# EAGLE design upperArm_preAR (EAGLE 9.6.2)
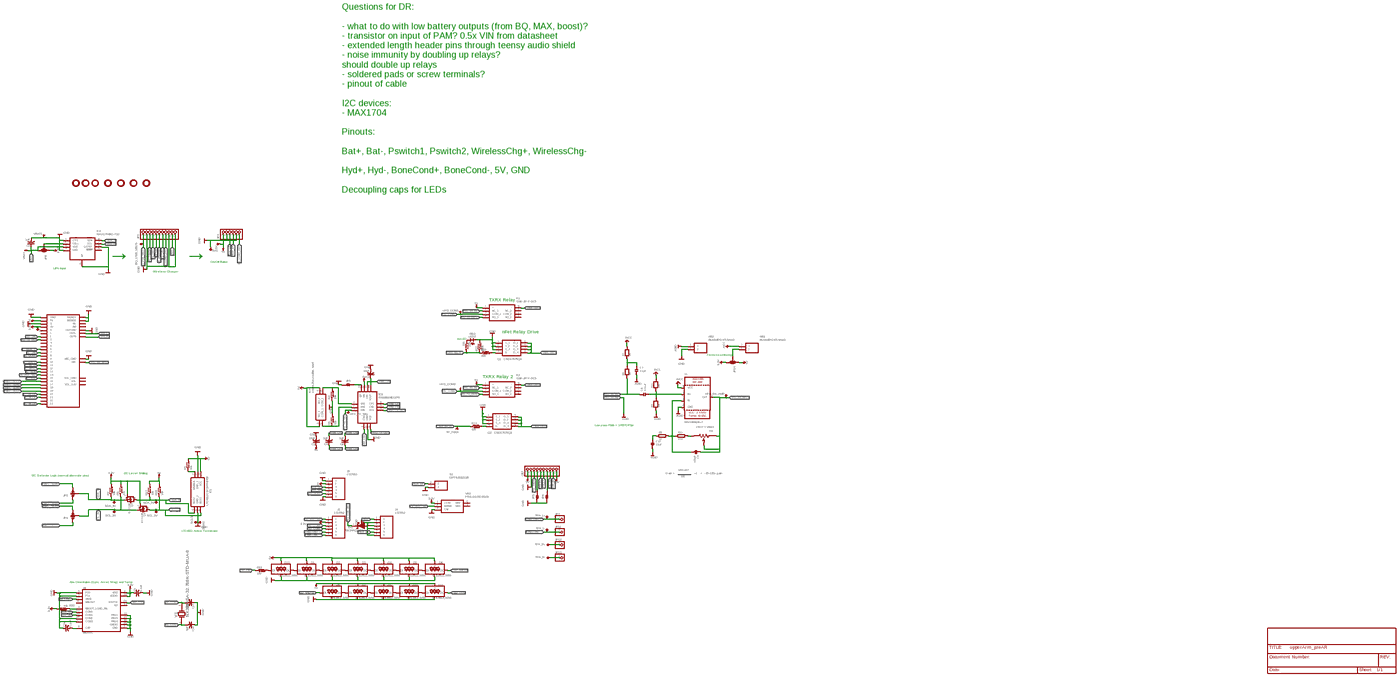
[diagram p0: schematic, sheet 1, overview]
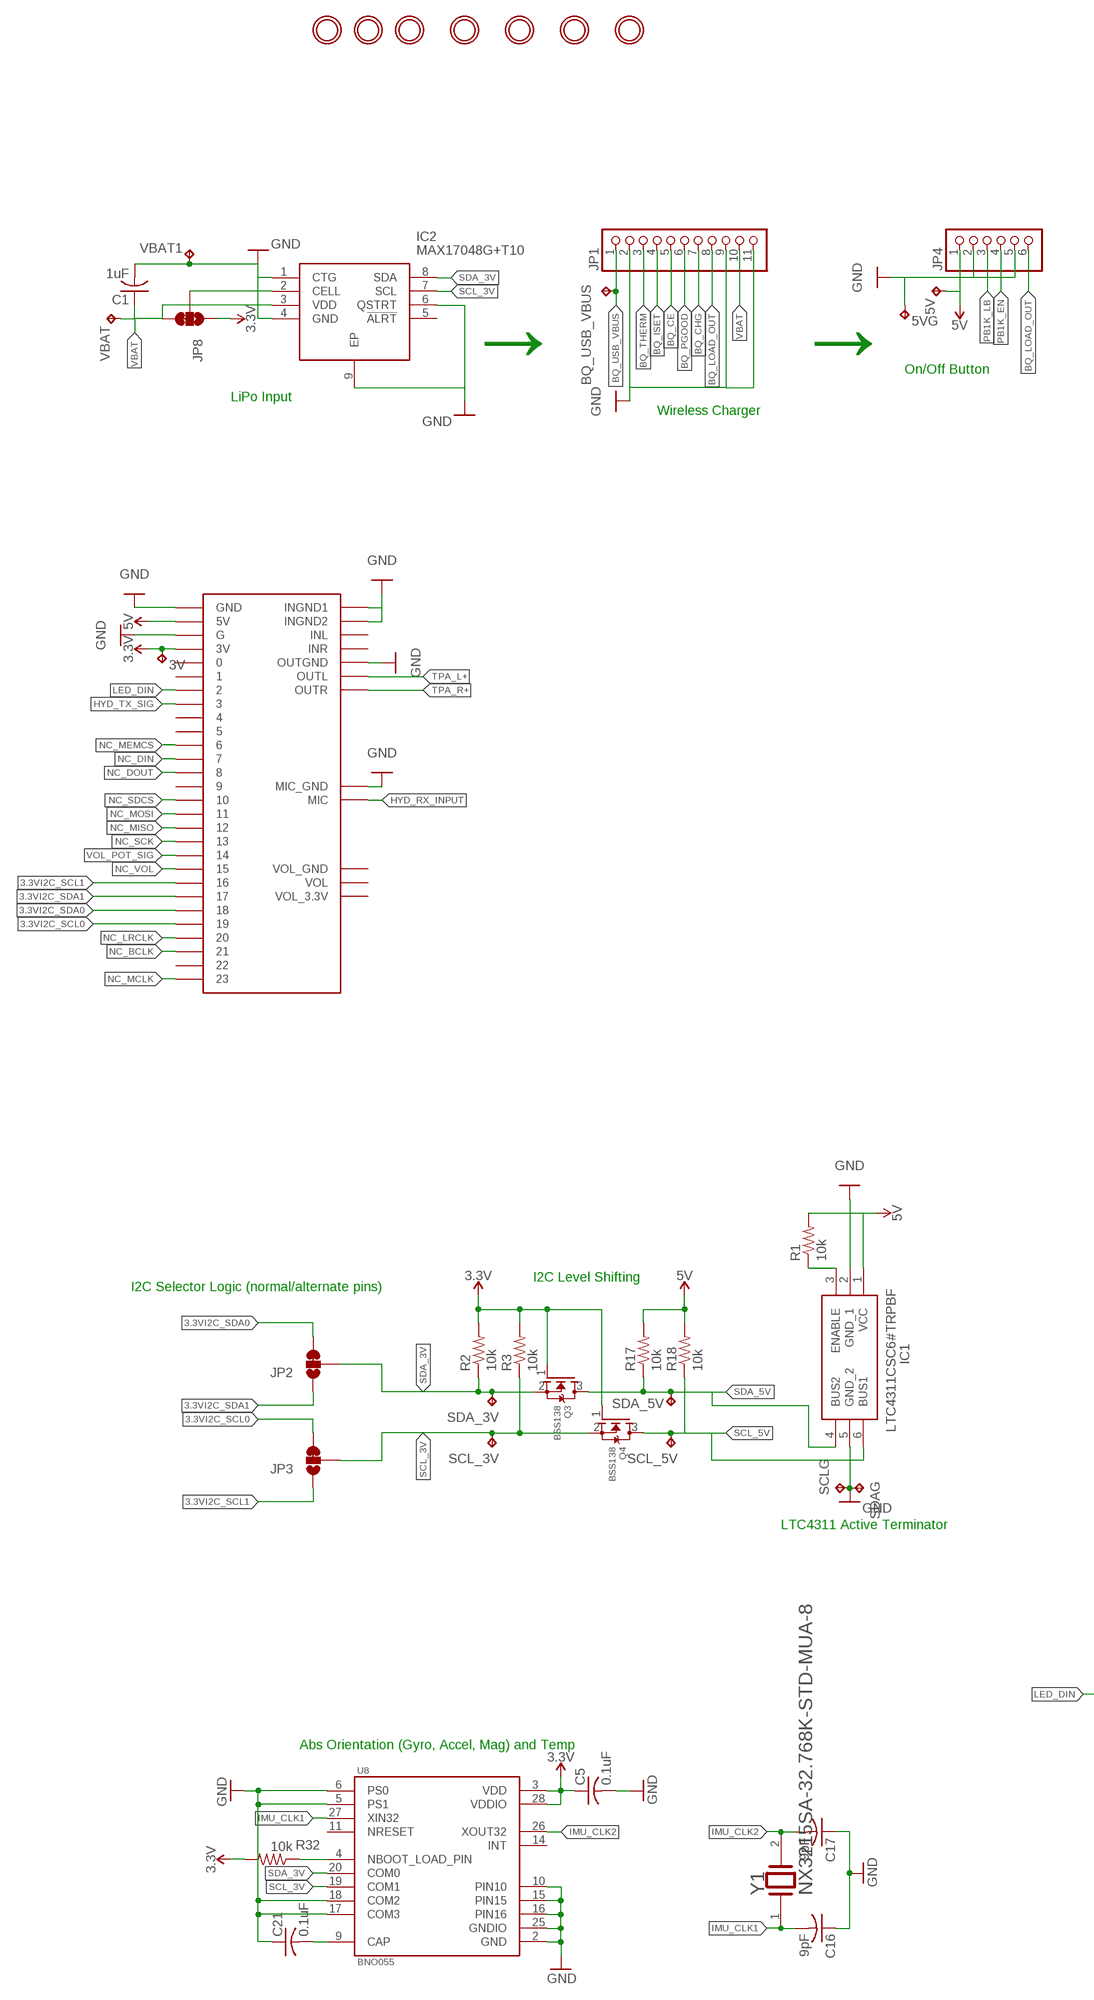
[diagram p1: schematic, sheet 1, part 1 of 4]
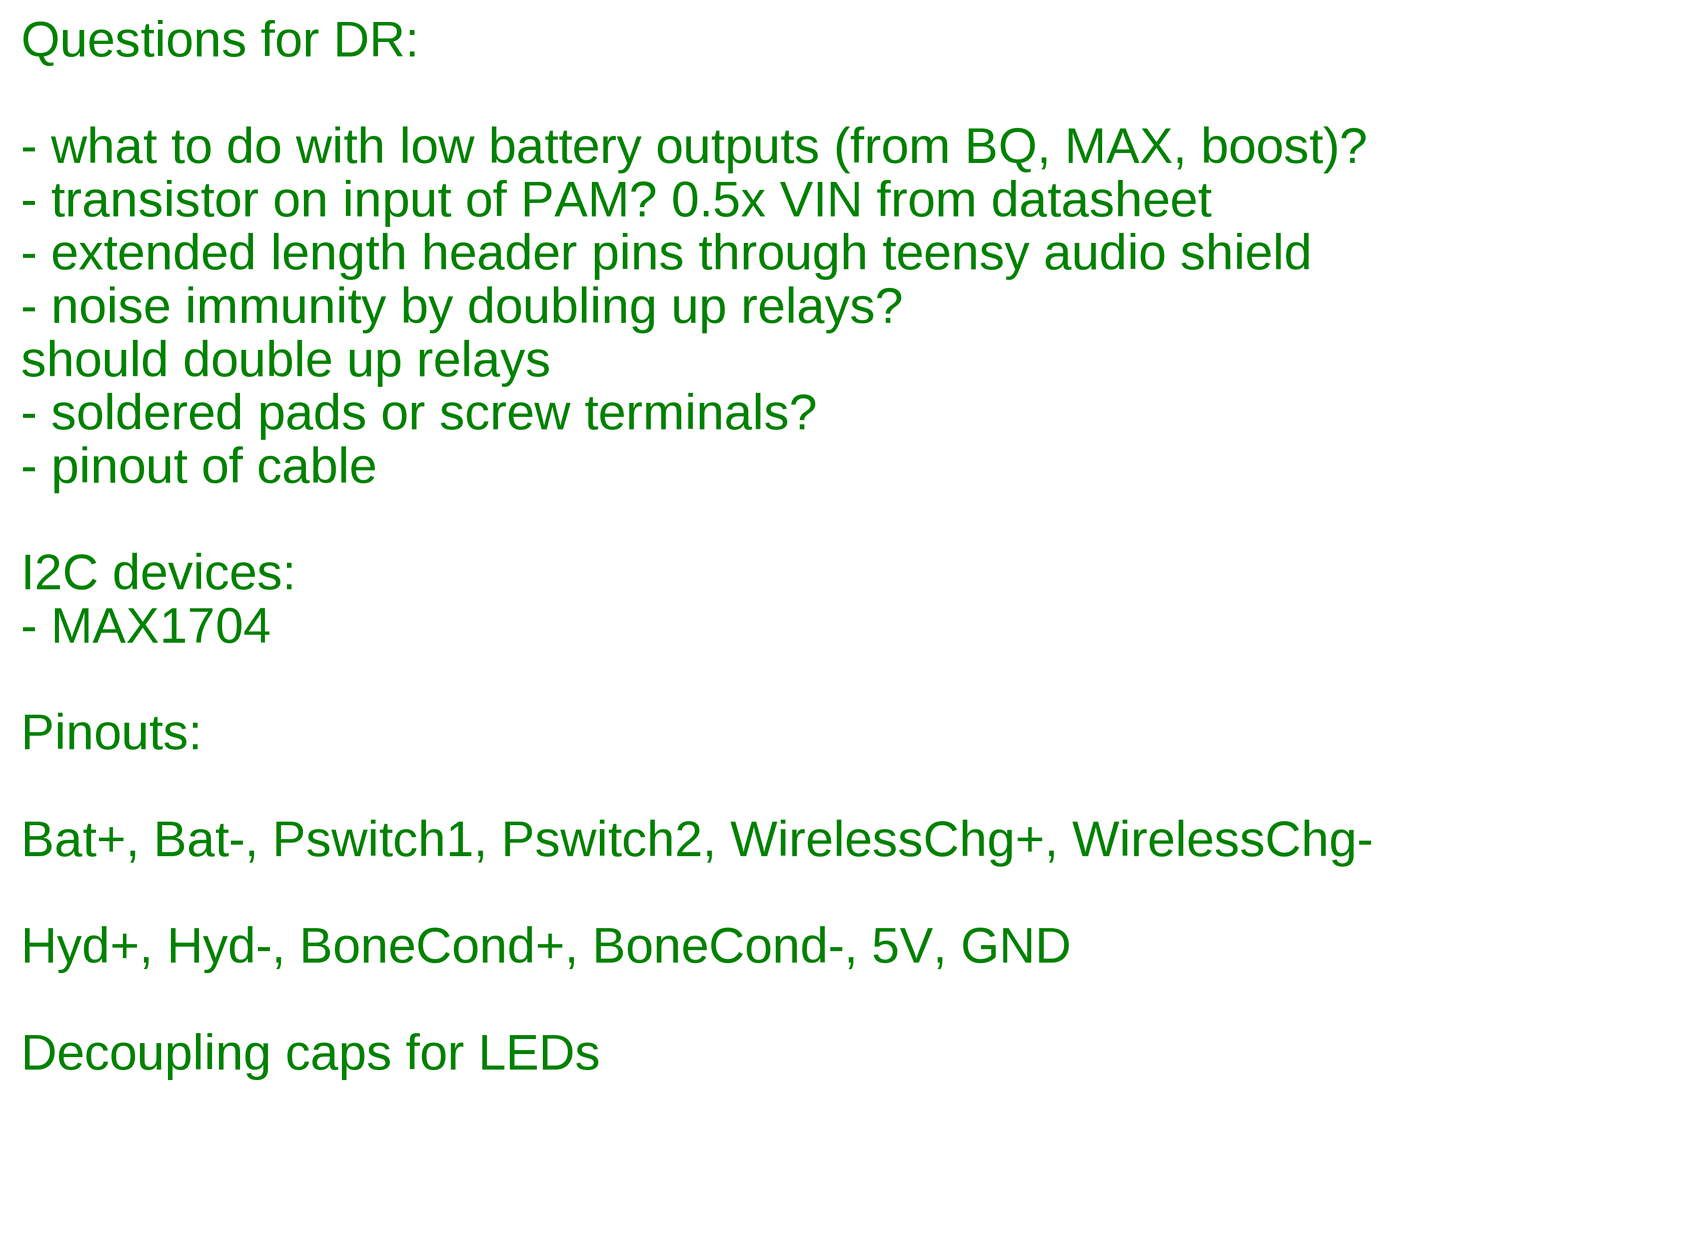
[diagram p2: schematic, sheet 1, part 2 of 4]
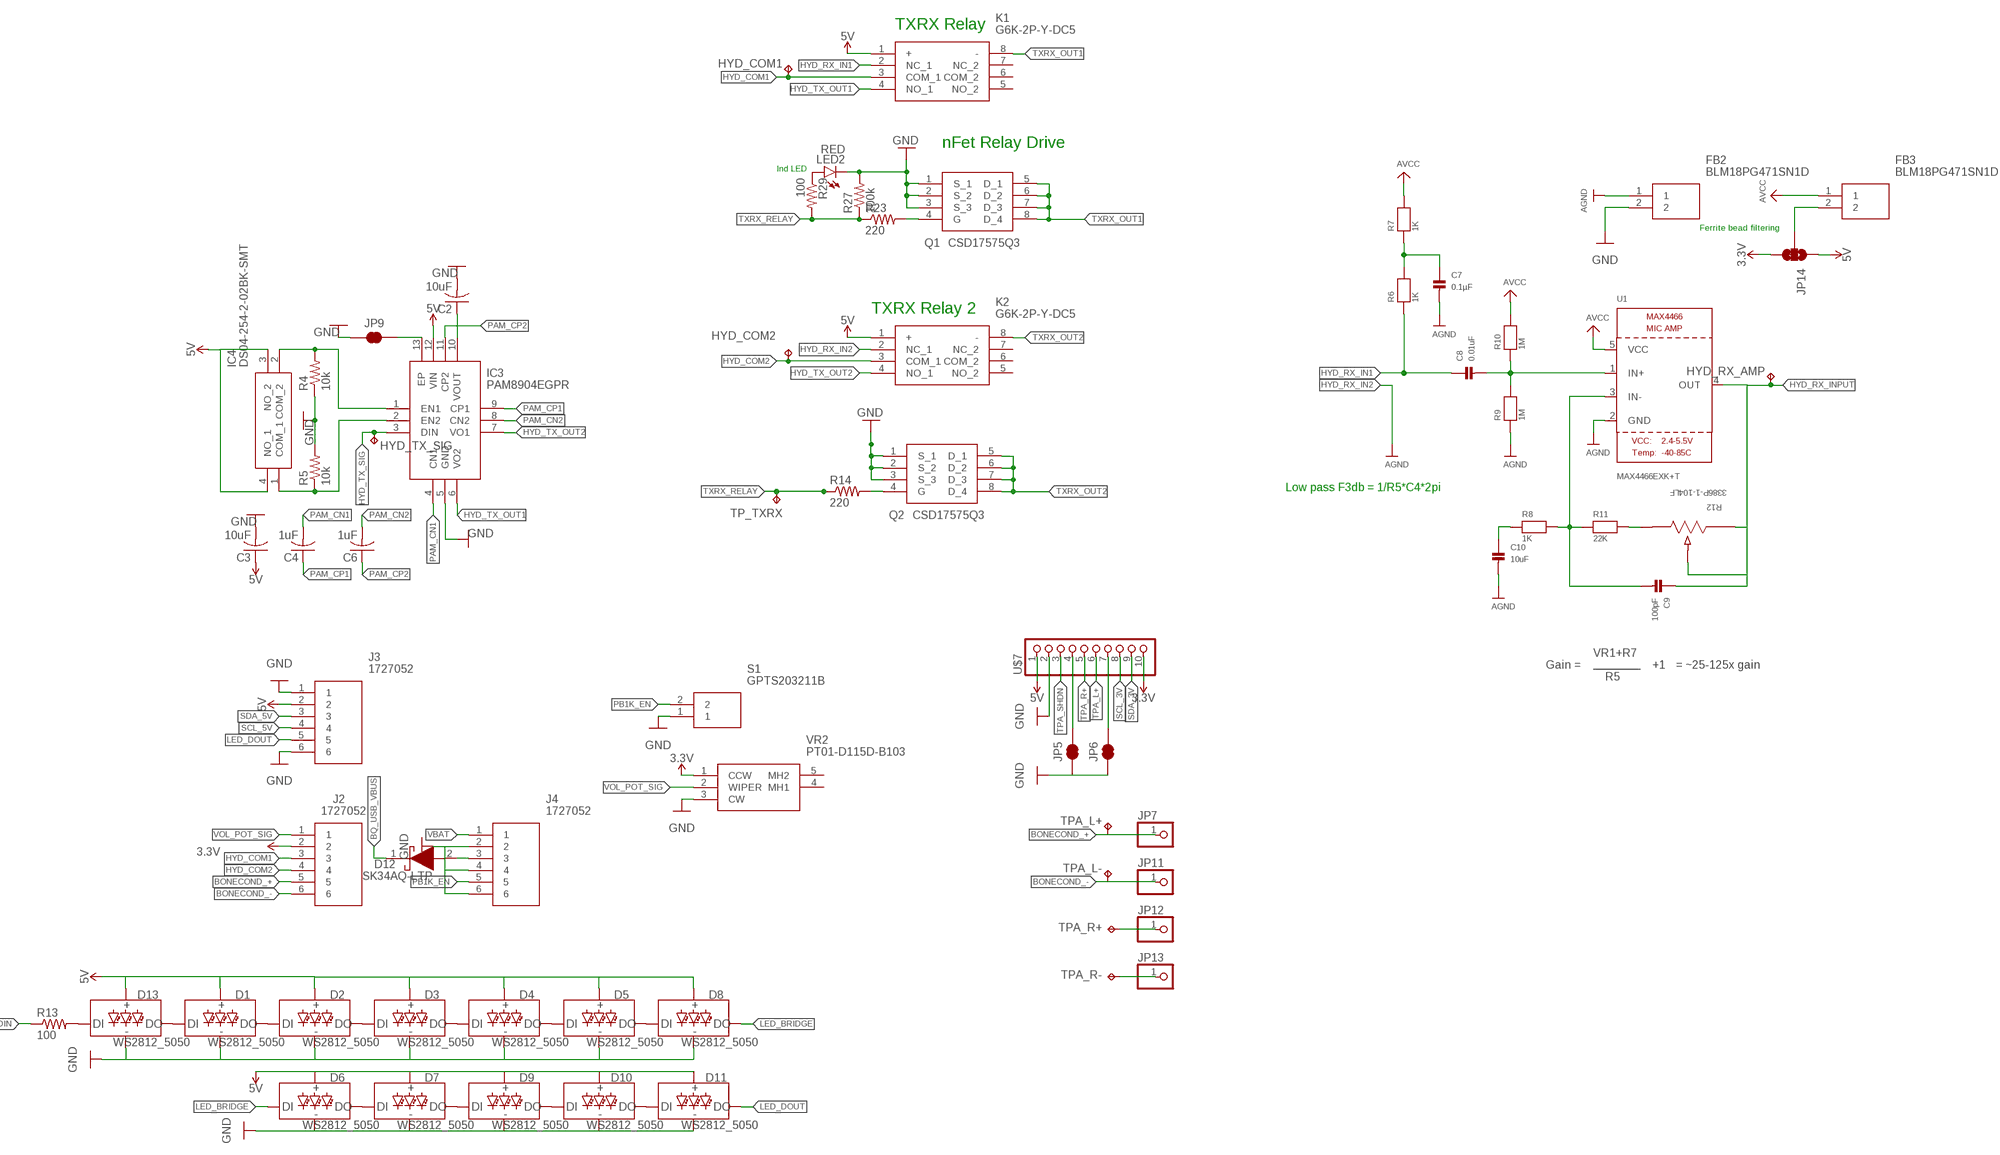
[diagram p3: schematic, sheet 1, part 3 of 4]
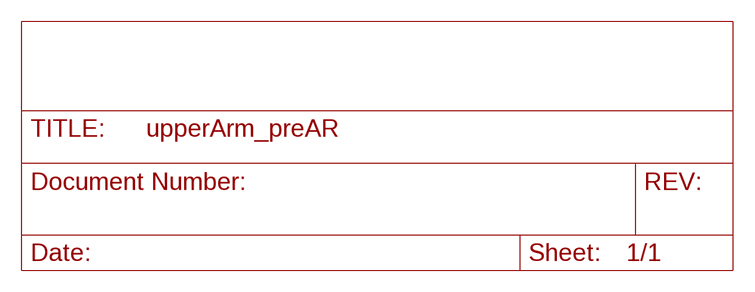
[diagram p4: schematic, sheet 1, part 4 of 4]

## Parts
3V  TPB1,27  [B1,27]
5V  TPB1,27  [B1,27]
5VG  TPB1,27  [B1,27]
BQ_USB_VBUS  TPB1,27  [B1,27]
C1  1uF  C-USC0805  [C0805]
C2  10uF  C-USC0805  [C0805]
C3  10uF  C-USC0805  [C0805]
C4  1uF  C-USC0805  [C0805]
C5  0.1uF  C-USC0805  [C0805]
C6  1uF  C-USC0805  [C0805]
C7  0.1µF  CAP_CERAMIC0805  [0805]
C8  0.01uF  CAP_CERAMIC0805  [0805]
C9  100pF  CAP_CERAMIC0805  [0805]
C10  10uF  CAP_CERAMIC0805  [0805]
C16  9pF  C-USC0805  [C0805]
C17  9pF  C-USC0805  [C0805]
C21  0.1uF  C-USC0805  [C0805]
D1  WS2812_5050  [WS2812-5X5-4PIN]
D2  WS2812_5050  [WS2812-5X5-4PIN]
D3  WS2812_5050  [WS2812-5X5-4PIN]
D4  WS2812_5050  [WS2812-5X5-4PIN]
D5  WS2812_5050  [WS2812-5X5-4PIN]
D6  WS2812_5050  [WS2812-5X5-4PIN]
D7  WS2812_5050  [WS2812-5X5-4PIN]
D8  WS2812_5050  [WS2812-5X5-4PIN]
D9  WS2812_5050  [WS2812-5X5-4PIN]
D10  WS2812_5050  [WS2812-5X5-4PIN]
D11  WS2812_5050  [WS2812-5X5-4PIN]
D12  SK34AQ-LTP  [DIOM5226X244N]
D13  WS2812_5050  [WS2812-5X5-4PIN]
FB2  BLM18PG471SN1D  [BLM18SP221SN1B]
FB3  BLM18PG471SN1D  [BLM18SP221SN1B]
HYD_COM1  TPB1,27  [B1,27]
HYD_COM2  TPB1,27  [B1,27]
HYD_RX_AMP  TPB1,27  [B1,27]
HYD_TX_SIG  TPB1,27  [B1,27]
IC1  LTC4311CSC6#TRPBF  [SOT65P210X100-6N]
IC2  MAX17048G+T10  [SON50P200X200X80-9N]
IC3  PAM8904EGPR  [QFN40P200X200X80-13N]
IC4  DS04-254-2-02BK-SMT  [DS04254202BKSMT]
J2  1727052  [1727052]
J3  1727052  [1727052]
J4  1727052  [1727052]
JP1  PINHD-1X11  [1X11]
JP2  JUMPER-SMT_3_1-NC_TRACE_NO-SILK  [SMT-JUMPER_3_1-NC_TRACE_NO-SILK]
JP3  JUMPER-SMT_3_1-NC_TRACE_NO-SILK  [SMT-JUMPER_3_1-NC_TRACE_NO-SILK]
JP4  PINHD-1X6  [1X06]
JP5  JUMPER-SMT_2_NC_TRACE_NO-SILK  [SMT-JUMPER_2_NC_TRACE_NO-SILK]
JP6  JUMPER-SMT_2_NC_TRACE_NO-SILK  [SMT-JUMPER_2_NC_TRACE_NO-SILK]
JP7  PINHD-1X1  [1X01]
JP8  JUMPER-SMT_3_1-NC_TRACE_NO-SILK  [SMT-JUMPER_3_1-NC_TRACE_NO-SILK]
JP9  JUMPER-SMT_2_NC_TRACE_NO-SILK  [SMT-JUMPER_2_NC_TRACE_NO-SILK]
JP11  PINHD-1X1  [1X01]
JP12  PINHD-1X1  [1X01]
JP13  PINHD-1X1  [1X01]
JP14  JUMPER-SMT_3_1-NC_TRACE_NO-SILK  [SMT-JUMPER_3_1-NC_TRACE_NO-SILK]
K1  G6K-2P-Y-DC5  [G6K2PYDC12]
K2  G6K-2P-Y-DC5  [G6K2PYDC12]
LED2  RED  LEDCHIP-LED0805  [CHIP-LED0805]
Q1  CSD17575Q3  [CSD16327]
Q2  CSD17575Q3  [CSD16327]
Q3  BSS138  MOSFET-NWIDE  [SOT23-WIDE]
Q4  BSS138  MOSFET-NWIDE  [SOT23-WIDE]
R1  10k  R-US_R0805  [R0805]
R2  10k  R-US_R0805  [R0805]
R3  10k  R-US_R0805  [R0805]
R4  10k  R-US_R0805  [R0805]
R5  10k  R-US_R0805  [R0805]
R6  1K  RESISTOR0805  [0805]
R7  1K  RESISTOR0805  [0805]
R8  1K  RESISTOR0805  [0805]
R9  1M  RESISTOR0805  [0805]
R10  1M  RESISTOR0805  [0805]
R11  22K  RESISTOR0805  [0805]
R12  3386P-1-104LF  [POT_3386P]
R13  100  R-US_R0603  [R0603]
R14  220  R-US_R0805  [R0805]
R17  10k  R-US_R0805  [R0805]
R18  10k  R-US_R0805  [R0805]
R23  220  R-US_R0805  [R0805]
R27  100k  R-US_R0805  [R0805]
R29  100  R-US_R0805  [R0805]
R32  10k  R-US_R0805  [R0805]
S1  GPTS203211B  [GPTS203211B]
SCL_3V  TPB1,27  [B1,27]
SCL_5V  TPB1,27  [B1,27]
SCLG  TPB1,27  [B1,27]
SDA_3V  TPB1,27  [B1,27]
SDA_5V  TPB1,27  [B1,27]
SDAG  TPB1,27  [B1,27]
TP_TXRX  TPB1,27  [B1,27]
TPA_L+  TPB1,27  [B1,27]
TPA_L-  TPB1,27  [B1,27]
TPA_R+  TPB1,27  [B1,27]
TPA_R-  TPB1,27  [B1,27]
U1  MAX4466EXK+T  MAX4466""  [SC70-5]
U8  BNO055  [LGA28R50P4X10_380X520X100]
U$1  AUDIOSHIELD  [AUDIOSHIELD]
U$7  PINHD-1X10  [1X10]
U$11  MOUNTINGHOLE2.5  [MOUNTINGHOLE_2.5_PLATED]
U$14  MOUNTINGHOLE2.5  [MOUNTINGHOLE_2.5_PLATED]
U$15  MOUNTINGHOLE2.5  [MOUNTINGHOLE_2.5_PLATED]
U$16  MOUNTINGHOLE2.5  [MOUNTINGHOLE_2.5_PLATED]
U$17  MOUNTINGHOLE2.5  [MOUNTINGHOLE_2.5_PLATED]
U$18  MOUNTINGHOLE2.5  [MOUNTINGHOLE_2.5_PLATED]
U$19  MOUNTINGHOLE2.5  [MOUNTINGHOLE_2.5_PLATED]
VBAT  TPB1,27  [B1,27]
VBAT1  TPB1,27  [B1,27]
VR2  PT01-D115D-B103  [PT01D115DB103]
Y1  NDK_NX3215SA-32.768K-STD-MUA-9  NDK_NX3215SA-32.768K-STD-MUA-8NDK_NX3215SA-32.768K-STD-MUA-8_0_0  [NDK_NX3215SA-32.768K-STD-MUA-8_0]

## Nets
3.3V [ICPower]: 3V.TP C5.1 J2.2 JP8.1 JP14.3 Q3.1(G) Q4.1(G) R2.2 R3.2 R32.2 U8.3(VDD) U8.28(VDDIO) U$1.3V U$7.10 VR2.1(CCW)
3.3VI2C_SCL0: JP3.3 U$1.19
3.3VI2C_SCL1: JP3.1 U$1.16
3.3VI2C_SDA0: JP2.3 U$1.18
3.3VI2C_SDA1: JP2.1 U$1.17
5V [ICPower]: 5V.TP C3.1 D1.VCC D2.VCC D3.VCC D4.VCC D5.VCC D6.VCC D7.VCC D8.VCC D9.VCC D10.VCC D11.VCC D13.VCC IC1.1(VCC) IC3.12(VIN) IC4.3(NO_2) IC4.4(NO_1) J3.2 JP4.1 JP14.1 K1.1(+) K2.1(+) R1.2 R17.2 R18.2 U$1.5V U$7.1
AGND: C7.2 C10.2 FB2.1 R9.1 U1.2(GND)
AVCC: FB3.1 R7.2 R10.2 U1.5(VCC)
BONECOND_+: J2.5 JP7.1 TPA_L+.TP
BONECOND_-: J2.6 JP11.1 TPA_L-.TP
BQ_CE: JP1.5
BQ_CHG: JP1.7
BQ_ISET: JP1.4
BQ_LOAD_OUT: JP1.8 JP4.6
BQ_PGOOD: JP1.6
BQ_THERM: JP1.3
BQ_USB_VBUS: BQ_USB_VBUS.TP D12.1(K) JP1.1
GND: 5VG.TP C1.2 C2.2 C3.2 C5.2 C16.1 C17.1 C21.1 D1.GND D2.GND D3.GND D4.GND D5.GND D6.GND D7.GND D8.GND D9.GND D10.GND D11.GND D13.GND FB2.2 IC1.2(GND_1) IC1.5(GND_2) IC2.1(CTG) IC2.4(GND) IC2.6(QSTRT) IC2.9(EP) IC3.5(GND) J3.1 J3.6 J4.2 J4.4 J4.6 JP1.2 JP1.9 JP1.11 JP4.2 JP4.5 JP5.1 JP6.1 JP9.1 LED2.C Q1.1(S_1) Q1.2(S_2) Q1.3(S_3) Q2.1(S_1) Q2.2(S_2) Q2.3(S_3) R4.1 R5.2 R27.2 S1.1 SCLG.TP SDAG.TP U8.2(GND) U8.5(PS1) U8.6(PS0) U8.10(PIN10) U8.15(PIN15) U8.16(PIN16) U8.17(COM3) U8.18(COM2) U8.25(GNDIO) U$1.G U$1.GND U$1.GND_MIC(MIC_GND) U$1.INGND1 U$1.INGND2 U$1.OUTGND U$7.2 VBAT1.TP VR2.3(CW)
HYD_COM1: HYD_COM1.TP J2.3 K1.3(COM_1)
HYD_COM2: HYD_COM2.TP J2.4 K2.3(COM_1)
HYD_RX_IN1: C8.1 K1.2(NC_1) R6.1
HYD_RX_IN2: K2.2(NC_1) ; supply symbol labelled AGND
HYD_RX_INPUT: C9.1 HYD_RX_AMP.TP R12.1 R12.2 U1.4(OUT) U$1.MIC
HYD_TX_OUT1: IC3.6(VO2) K1.4(NO_1)
HYD_TX_OUT2: IC3.7(VO1) K2.4(NO_1)
HYD_TX_SIG: HYD_TX_SIG.TP IC3.3(DIN) U$1.3
IMU_CLK1: C16.2 U8.27(XIN32) Y1.1
IMU_CLK2: C17.2 U8.26(XOUT32) Y1.2
LED_BRIDGE: D6.DI D8.DO
LED_DIN: R13.1 U$1.2
LED_DOUT: D11.DO J3.5
N$1: IC1.3(ENABLE) R1.1
N$2: JP12.1 TPA_R+.TP
N$3: JP13.1 TPA_R-.TP
N$4: D6.DO D7.DI
N$5: IC2.2(CELL) JP8.2
N$6: Q2.4(G) R14.2
N$7: C2.1 IC3.10(VOUT)
N$8: D13.DI R13.2
N$9: JP5.2 U$7.4
N$10: D1.DO D2.DI
N$11: IC3.13(EP) JP9.2
N$12: IC3.1(EN1) IC4.2(COM_2) R4.2
N$13: IC3.2(EN2) IC4.1(COM_1) R5.1
N$15: FB3.2 JP14.2
N$16: C7.1 R6.2 R7.1
N$17: C8.2 R9.2 R10.1 U1.1(IN+)
N$18: D1.DI D13.DO
N$19: C9.2 R8.2 R11.1 U1.3(IN-)
N$20: C10.1 R8.1
N$21: R11.2 R12.3
N$24: D12.2(A) J4.3
N$25: D2.DO D3.DI
N$26: D3.DO D4.DI
N$27: D4.DO D5.DI
N$28: D5.DO D8.DI
N$29: D7.DO D9.DI
N$30: D9.DO D10.DI
N$31: D10.DO D11.DI
N$32: JP6.2 U$7.7
N$37: C21.2 U8.9(CAP)
N$40: R32.1 U8.4(NBOOT_LOAD_PIN)
N$81: Q1.4(G) R23.2
N$82: LED2.A R29.1
NC_BCLK: U$1.21
NC_DIN: U$1.7
NC_DOUT: U$1.8
NC_LRCLK: U$1.20
NC_MCLK: U$1.23
NC_MEMCS: U$1.6
NC_MISO: U$1.12
NC_MOSI: U$1.11
NC_SCK: U$1.13
NC_SDCS: U$1.10
NC_VOL: U$1.15
PAM_CN1: C4.2 IC3.4(CN1)
PAM_CN2: C6.2 IC3.8(CN2)
PAM_CP1: C4.1 IC3.9(CP1)
PAM_CP2: C6.1 IC3.11(CP2)
PB1K_EN: J4.5 JP4.4 S1.2
PB1K_LB: JP4.3
SCL_3V: IC2.7(SCL) JP3.2 Q4.2(S) R3.1 SCL_3V.TP U8.19(COM1) U$7.8
SCL_5V: IC1.6(BUS1) J3.4 Q4.3(D) R18.1 SCL_5V.TP
SDA_3V: IC2.8(SDA) JP2.2 Q3.2(S) R2.1 SDA_3V.TP U8.20(COM0) U$7.9
SDA_5V: IC1.4(BUS2) J3.3 Q3.3(D) R17.1 SDA_5V.TP
TPA_L+: U$1.OUTL U$7.6
TPA_R+: U$1.OUTR U$7.5
TPA_SHDN: U$7.3
TXRX_OUT1 [Pyro]: K1.8(-) Q1.5(D_1) Q1.6(D_2) Q1.7(D_3) Q1.8(D_4)
TXRX_OUT2 [Pyro]: K2.8(-) Q2.5(D_1) Q2.6(D_2) Q2.7(D_3) Q2.8(D_4)
TXRX_RELAY: R14.1 R23.1 R27.1 R29.2 TP_TXRX.TP
VBAT: C1.1 IC2.3(VDD) J4.1 JP1.10 JP8.3 VBAT.TP
VOL_POT_SIG: J2.1 U$1.14 VR2.2(WIPER)
Unconnected: IC2.5(!ALRT) K1.5(NO_2) K1.6(COM_2) K1.7(NC_2) K2.5(NO_2) K2.6(COM_2) K2.7(NC_2) U8.11(NRESET) U8.14(INT) U$1.0 U$1.1 U$1.4 U$1.5 U$1.9 U$1.22 U$1.INL U$1.INR U$1.VOL U$1.VOL_3.3V U$1.VOL_GND VR2.4(MH1) VR2.5(MH2)

## Notes on the sheet
- Questions for DR:
  
  - what to do with low battery outputs (from BQ, MAX, boost)?
  - transistor on input of PAM? 0.5x VIN from datasheet 
  - extended length header pins through teensy audio shield
  - noise immunity by doubling up relays?
  should double up relays
  - soldered pads or screw terminals?
  - pinout of cable
  
  I2C devices:
  - MAX1704
  
  Pinouts:
  
  Bat+, Bat-, Pswitch1, Pswitch2, WirelessChg+, WirelessChg-
  
  Hyd+, Hyd-, BoneCond+, BoneCond-, 5V, GND
  
  Decoupling caps for LEDs
- → | →
- On/Off Button
- LiPo Input
- Wireless Charger
- TXRX Relay
- nFet Relay Drive
- Ind LED
- Ferrite bead filtering
- TXRX Relay 2
- Low pass F3db = 1/R5*C4*2pi
- VR1+R7
- I2C Selector Logic (normal/alternate pins) | I2C Level Shifting | Gain = | +1 | = ~25-125x gain
- R5
- LTC4311 Active Terminator
- Abs Orientation (Gyro, Accel, Mag) and Temp

## Library data of the parts
3V 5V 5VG BQ_USB_VBUS HYD_COM1 HYD_COM2 HYD_RX_AMP HYD_TX_SIG SCL_3V SCL_5V SCLG SDA_3V SDA_5V SDAG TP_TXRX TPA_L+ TPA_L- TPA_R+ TPA_R- VBAT VBAT1 = testpad:TP: Test pad
C1-C6 C16 C17 C21 = rcl:C-US: CAPACITOR, American symbol; SPICEPREFIX: C
C7-C10 = microbuilder:CAP_CERAMIC: Ceramic Capacitors 0402 - 0402 Surface Mount Capacitors 16pF 50V 5% [Digikey: 445-4899-2-ND] 18pF 50V 5% [Digikey: 490-1281-2-ND] 22pF 50V 5% [Digikey: 490-1283-2-ND] 68pF 50V 5% [Digikey: 490-1289-2-ND] 0.1uF 10V 10% [Digikey: 490-1318-2-ND] 1.0uF 6.3V 10% [Digikey: 490-1320-2-ND] 0603 - 0603 Surface Mount Capacitors 16 pF 50V 5% [Digikey: 445-5051-2-ND] 22 pF 50V [Digikey: PCC220ACVTR-ND] 33 pF 50V 5% [Digikey: 490-1415-1-ND] 56pF 50V 5% [Digikey: 490-1421-1-ND] 220pF 50V 5% [Digikey: 445-1285-1-ND] 680 pF 50V 2200 pF 50V 5% C0G [Digikey: 445-1297-1-ND] 5600 pF 100V 5% X7R [Digikey: 478-3711-1-ND] 0.1 µF 25V 10% [Digikey: PCC2277TR-ND] 0.22 µF 16V 10% X7R [Digikey: 445-1318-1-ND] 1.0 µF 25V 10% [Digikey: 445-5146-2-ND] 0603 - RF Specific 3pF 250V +/-0.1pF RF [Digikey: 712-1347-1-ND] 18 pF 250V 5% [Digikey: 478-3505-1-ND or 712-1322-1-ND] 56 pF 250V 5% C0G RF [Digikey: 490-4867-1-ND] 68 pF 250V RF [Digikey: 490-4868-1-ND] 0805 - 0805 Surface Mount Capacitors 220 pF 250V 2% RF Ceramic Capacitor [Digikey: 712-1398-1-ND] 1000 pF 50V 2% NP0 Ceramic Capacitor [Digikey: 478-3760-1-ND] 0.1 µF 25V 10% Ceramic Capacitor [Digikey: PCC1828TR-ND] 1.0 µF 16V 10% Ceramic Capacitor[Digikey: 490-1691-2-ND] 10.0 µF 10V 10% Ceramic Capacitor[Digikey: 709-1228-1-ND] 10.0 uF 16V 10% Ceramic Capacitor [Digikey: 478-5165-2-ND] 47 uF 6.3V 20% Ceramic Capacitor [Digikey: 587-1779-1-ND or 399-5506-1-ND] 1206 - 1206 Surface Mount Capacitors 47uF 10V 20% Ceramic Capacitor [Digikey: 490-5528-1-ND or 399-5508-1-ND or 445-6010-1-ND] 100uF 6.3V -20%, +80% Y5V Ceramic Capacitor (Digikey: 490-4512-1-ND, Mouser: 81-GRM31CF50J107ZE1L)
D1-D11 D13 = SparkFun-LED:WS2812: Addressable RGB LED - 1 Wire Common names: WS2812, SK6812, Neopixel, APA-106, etc. SMD LED with built-in controller IC. Color: Red/Green/Blue SparkFun Products: LED-SMD RGB (WS2812) <https://www.sparkfun.com/products/11821> LED - RGB Addressable, PTH, 5mm Diffused (5 Pack) <https://www.sparkfun.com/products/12986> LED - RGB Addressable, PTH, 5mm Clear (5 Pack) <https://www.sparkfun.com/products/12999> Blynk Board - ESP8266 <https://www.sparkfun.com/products/13794> Datasheet referenced for footprint: WS2812B-PTH <https://cdn.sparkfun.com/datasheets/Components/LED/COM-12877.pdf>; PROD_ID: DIO-12503
D12 = SamacSys_Parts:SK34AQ-LTP: SCHOTTKY BARRIER RECTIFIERS 40V 3A,SMA Source: Datasheet <https://mccsemi.com/pdf/Products/SK34AQ-L_SK36AQ-L(SMA).pdf>; ARROW_PART_NUMBER: SK34AQ-LTP; ARROW_PRICE-STOCK: https://www.arrow.com/en/products/sk34aq-ltp/micro-commercial-components?region=nac; DESCRIPTION: SCHOTTKY BARRIER RECTIFIERS 40V 3A,SMA; HEIGHT: 2.44mm; MANUFACTURER_NAME: MCC; MANUFACTURER_PART_NUMBER: SK34AQ-LTP; MOUSER_PART_NUMBER: 833-SK34AQ-LTP; MOUSER_PRICE-STOCK: https://www.mouser.co.uk/ProductDetail/Micro-Commercial-Components-MCC/SK34AQ-LTP?qs=ulEaXIWI0c8bpRN15seU2Q%3D%3D
FB2 FB3 = SamacSys_Parts:BLM18PG471SN1D: 0603 Ferrite Bead,470R,25%,1A,R2 Source: Datasheet <http://www.murata.com/~/media/webrenewal/support/library/catalog/products/emc/emifil/c31e.ashx?la=en-gb>; ARROW_PART_NUMBER: BLM18PG471SN1D; ARROW_PRICE-STOCK: https://www.arrow.com/en/products/blm18pg471sn1d/murata-manufacturing?region=nac; DESCRIPTION: 0603 Ferrite Bead,470R,25%,1A,R2; HEIGHT: 0.95mm; MANUFACTURER_NAME: Murata Electronics; MANUFACTURER_PART_NUMBER: BLM18PG471SN1D; MOUSER_PART_NUMBER: 81-BLM18PG471SN1D; MOUSER_PRICE-STOCK: https://www.mouser.co.uk/ProductDetail/Murata-Electronics/BLM18PG471SN1D?qs=EYzdjubb4S%2FN1Ip39GrHyg%3D%3D
IC1 = SamacSys_Parts:LTC4311CSC6#TRPBF: Interface - Specialized I2C/SMBus Rise Time Accelerator Source: Datasheet <https://www.analog.com/media/en/technical-documentation/data-sheets/4311fa.pdf>; ARROW_PART_NUMBER: LTC4311CSC6#TRPBF; ARROW_PRICE-STOCK: https://www.arrow.com/en/products/ltc4311csc6trpbf/analog-devices?region=nac; DESCRIPTION: Interface - Specialized I2C/SMBus Rise Time Accelerator; HEIGHT: 1mm; MANUFACTURER_NAME: Analog Devices; MANUFACTURER_PART_NUMBER: LTC4311CSC6#TRPBF; MOUSER_PART_NUMBER: 584-LTC4311CSC6TRPBF; MOUSER_PRICE-STOCK: https://www.mouser.co.uk/ProductDetail/Analog-Devices/LTC4311CSC6TRPBF?qs=hVkxg5c3xu8dDGkXCTUXoQ%3D%3D
IC2 = SamacSys_Parts:MAX17048G+T10: 3A 1-Cell/2-Cell Fuel Gauge with ModelGauge Source: Datasheet <https://www.analog.com/MAX17048/datasheet>; ARROW_PART_NUMBER: MAX17048G+T10; ARROW_PRICE-STOCK: https://www.arrow.com/en/products/max17048gt10/analog-devices?region=nac; DESCRIPTION: 3A 1-Cell/2-Cell Fuel Gauge with ModelGauge; HEIGHT: 0.8mm; MANUFACTURER_NAME: Analog Devices; MANUFACTURER_PART_NUMBER: MAX17048G+T10; MOUSER_PART_NUMBER: 700-MAX17048G+T10; MOUSER_PRICE-STOCK: https://www.mouser.co.uk/ProductDetail/Analog-Devices-Maxim-Integrated/MAX17048G%2bT10?qs=D7PJwyCwLAoGnnn8jEPRBQ%3D%3D
IC3 = SamacSys_Parts:PAM8904EGPR: Audio Amplifiers Audio High Volt Source: Datasheet <https://www.diodes.com//assets/Datasheets/PAM8904E.pdf>; ARROW_PART_NUMBER: PAM8904EGPR; ARROW_PRICE-STOCK: https://www.arrow.com/en/products/pam8904egpr/diodes-incorporated; DESCRIPTION: Audio Amplifiers Audio High Volt; HEIGHT: 0.8mm; MANUFACTURER_NAME: Diodes Incorporated; MANUFACTURER_PART_NUMBER: PAM8904EGPR; MOUSER_PART_NUMBER: 621-PAM8904EGPR; MOUSER_PRICE-STOCK: https://www.mouser.co.uk/ProductDetail/Diodes-Incorporated/PAM8904EGPR?qs=EBDBlbfErPxEsxcCuoWH6w%3D%3D
IC4 = SamacSys_Parts:DS04-254-2-02BK-SMT: DIP Switches / SIP Switches DIP Switch, SPST, 2.54 pitch, flat actuator, SMT, 2 position, Black Source: Datasheet <https://pt.mouser.com/datasheet/2/670/ds04_254_smt-1777718.pdf>; ARROW_PART_NUMBER: DS04-254-2-02BK-SMT; ARROW_PRICE-STOCK: https://www.arrow.com/en/products/ds04-254-2-02bk-smt/cui-devices?region=nac; DESCRIPTION: DIP Switches / SIP Switches DIP Switch, SPST, 2.54 pitch, flat actuator, SMT, 2 position, Black; HEIGHT: 4.85mm; MANUFACTURER_NAME: Same Sky; MANUFACTURER_PART_NUMBER: DS04-254-2-02BK-SMT; MOUSER_PART_NUMBER: 490-DS04254202BK-SMT; MOUSER_PRICE-STOCK: https://www.mouser.co.uk/ProductDetail/Same-Sky/DS04-254-2-02BK-SMT?qs=wnTfsH77Xs4sTcTiPxa5bg%3D%3D
J2-J4 = SamacSys_Parts:1727052: PCB terminal block, nominal current: 13.5 A, rated voltage (III/2): 200 V, nominal cross section: 1.5 mm?, Number of potentials: 6, Number of rows: 1, Number of positions per row: 6, product range: MKDS 1, pitch: 3.81 mm, connection method: Screw connection with tension sleeve, mounting: Wave soldering, conductor/PCB connection direction: 0 ?, color: green, Pin layout: Linear pinning, Solder pin [P]: 3.5 mm, type of packaging: packed in cardboard Source: Datasheet <http://www.phoenixcontact.com/de/produkte/1727052/pdf>; ARROW_PART_NUMBER: 1727052; ARROW_PRICE-STOCK: https://www.arrow.com/en/products/1727052/phoenix-contact?region=nac; DESCRIPTION: PCB terminal block, nominal current: 13.5 A, rated voltage (III/2): 200 V, nominal cross section: 1.5 mm?, Number of potentials: 6, Number of rows: 1, Number of positions per row: 6, product range: MKDS 1, pitch: 3.81 mm, connection method: Screw connection with tension sleeve, mounting: Wave soldering, conductor/PCB connection direction: 0 ?, color: green, Pin layout: Linear pinning, Solder pin [P]: 3.5 mm, type of packaging: packed in cardboard; HEIGHT: 8.65mm; MANUFACTURER_NAME: Phoenix Contact; MANUFACTURER_PART_NUMBER: 1727052; MOUSER_PART_NUMBER: 651-1727052; MOUSER_PRICE-STOCK: https://www.mouser.co.uk/ProductDetail/Phoenix-Contact/1727052?qs=WWq3Ki8dym7VpMyTMk0i8A%3D%3D
JP1 = pinhead:PINHD-1X11: PIN HEADER
JP2 JP3 JP8 JP14 = SparkFun-Jumpers:JUMPER-SMT_3_1-NC_TRACE: Normally closed trace jumper (1 of 2 connections) This jumper has a trace between two pads so it's normally closed (NC). The other connection is normally open (NO). Use a razor knife to open the connection. For best results follow the IPC guidelines for cutting traces: Cutout at least 0.063 mm (0.005 in). Remove all loose material to clean up the cut area. Seal the cut with an approved epoxy. Reapply solder to reclose the connection, or to close the NO connection.
JP4 = pinhead:PINHD-1X6: PIN HEADER
JP5 JP6 JP9 = SparkFun-Jumpers:JUMPER-SMT_2_NC_TRACE: Normally closed trace jumper This jumper has a trace between two pads so it's normally closed (NC). Use a razor knife to open the connection. For best results follow the IPC guidelines for cutting traces: Cutout at least 0.063 mm (0.005 in). Remove all loose material to clean up the cut area. Seal the cut with an approved epoxy. Reapply solder to reclose the connection.
JP7 JP11-JP13 = pinhead:PINHD-1X1: PIN HEADER
K1 K2 = SamacSys_Parts:G6K-2P-Y-DC5: Low Signal Relays - PCB ThruHole NoLatch 3.2 DPDT 5VDC 100mW Source: Datasheet <https://omronfs.omron.com/en_US/ecb/products/pdf/en-g6k.pdf>; DESCRIPTION: Low Signal Relays - PCB ThruHole NoLatch 3.2 DPDT 5VDC 100mW; HEIGHT: 5.3mm; MANUFACTURER_NAME: Omron Electronics; MANUFACTURER_PART_NUMBER: G6K-2P-Y-DC5; MOUSER_PART_NUMBER: 653-G6K-2P-Y-DC5; MOUSER_PRICE-STOCK: https://www.mouser.co.uk/ProductDetail/Omron-Electronics/G6K-2P-Y-DC5?qs=HDDQUw%2F3PhrvM4dCY49XOA%3D%3D
LED2 = led:LED: LED OSRAM: - CHIPLED LG R971, LG N971, LY N971, LG Q971, LY Q971, LO R971, LY R971 LH N974, LH R974 LS Q976, LO Q976, LY Q976 LO Q996 - Hyper CHIPLED LW Q18S LB Q993, LB Q99A, LB R99A - SideLED LS A670, LO A670, LY A670, LG A670, LP A670 LB A673, LV A673, LT A673, LW A673 LH A674 LY A675 LS A676, LA A676, LO A676, LY A676, LW A676 LS A679, LY A679, LG A679 - Hyper Micro SIDELED® LS Y876, LA Y876, LO Y876, LY Y876 LT Y87S - SmartLED LW L88C, LW L88S LB L89C, LB L89S, LG L890 LS L89K, LO L89K, LY L89K LS L896, LA L896, LO L896, LY L896 - TOPLED LS T670, LO T670, LY T670, LG T670, LP T670 LSG T670, LSP T670, LSY T670, LOP T670, LYG T670 LG T671, LOG T671, LSG T671 LB T673, LV T673, LT T673, LW T673 LH T674 LS T676, LA T676, LO T676, LY T676, LB T676, LH T676, LSB T676, LW T676 LB T67C, LV T67C, LT T67C, LS T67K, LO T67K, LY T67K, LW E67C LS E67B, LA E67B, LO E67B, LY E67B, LB E67C, LV E67C, LT E67C LW T67C LS T679, LY T679, LG T679 LS T770, LO T770, LY T770, LG T770, LP T770 LB T773, LV T773, LT T773, LW T773 LH T774 LS E675, LA E675, LY E675, LS T675 LS T776, LA T776, LO T776, LY T776, LB T776 LHGB T686 LT T68C, LB T68C - Hyper Mini TOPLED® LB M676 - Mini TOPLED Santana® LG M470 LS M47K, LO M47K, LY M47K Source: http://www.osram.convergy.de LUXEON: - LUMILED® LXK2-PW12-R00, LXK2-PW12-S00, LXK2-PW14-U00, LXK2-PW14-V00 LXK2-PM12-R00, LXK2-PM12-S00, LXK2-PM14-U00 LXK2-PE12-Q00, LXK2-PE12-R00, LXK2-PE12-S00, LXK2-PE14-T00, LXK2-PE14-U00 LXK2-PB12-K00, LXK2-PB12-L00, LXK2-PB12-M00, LXK2-PB14-N00, LXK2-PB14-P00, LXK2-PB14-Q00 LXK2-PR12-L00, LXK2-PR12-M00, LXK2-PR14-Q00, LXK2-PR14-R00 LXK2-PD12-Q00, LXK2-PD12-R00, LXK2-PD12-S00 LXK2-PH12-R00, LXK2-PH12-S00 LXK2-PL12-P00, LXK2-PL12-Q00, LXK2-PL12-R00 Source: www.luxeon.com KINGBRIGHT: KA-3528ASYC Source: www.kingbright.com
Q1 Q2 = SamacSys_Parts:CSD17575Q3: 30V, N ch NexFET MOSFET, single SON3x3, 3.2mOhm Source: Datasheet <http://www.ti.com/lit/gpn/csd17575q3>; ARROW_PART_NUMBER: CSD17575Q3; ARROW_PRICE-STOCK: https://www.arrow.com/en/products/csd17575q3/texas-instruments; DESCRIPTION: 30V, N ch NexFET MOSFET, single SON3x3, 3.2mOhm; HEIGHT: mm; MANUFACTURER_NAME: Texas Instruments; MANUFACTURER_PART_NUMBER: CSD17575Q3; MOUSER_PART_NUMBER: 595-CSD17575Q3; MOUSER_PRICE-STOCK: https://www.mouser.co.uk/ProductDetail/Texas-Instruments/CSD17575Q3?qs=1MXlzafEN3%2FTIl0%2FpyGUYQ%3D%3D
Q3 Q4 = microbuilder:MOSFET-N: N-Channel Mosfet LEGEND VDS: Voltage Drain-Source ID: Drain Current RDS(ON): Drain-Source On-State Resistance VGS(TH): Gate-Source Threshold Voltage CISS: Drain-Source Input Capacitance SOT-23 Name VDS ID RDS(ON) VGS(TH) CISS Order Number 2N7002E 60V 260mA 2.5 Ohm 2.5V @ 250uA 26.7pF @ 25V 2N7002ET1GOSTR-ND BSH103 30V 850mA 400 mOhm 400mV @ 1mA 83pF @ 24V BSH103,235-ND BSS138 60V 320mA 1.6 Ohm 1.5V @ 250uA 50pF @ 10V Mouser: 771-BSS138PW115 DMN2075U-7 20V 4.2A 38 mOhm 1V @ 250 uA 594.3pF @ 10V DMN2075U-7DICT-ND * BSS138 good choice for I2C level-shifting
R1-R5 R13 R14 R17 R18 R23 R27 R29 R32 = rcl:R-US_: RESISTOR, American symbol; SPICEPREFIX: R
R6-R11 = microbuilder:RESISTOR: Resistors 0402 - 0402 Surface Mount Package 22 Ohm 1% 1/16W [Digikey: 311-22.0LRTR-ND] 33 Ohm 5% 1/16W 1.0K 5% 1/16W 1.5K 5% 1/16W 2.0K 1% 1/16W 10.0K 1% 1/16W [Digikey: 311-10.0KLRTR-ND] 10.0K 5% 1/16W [Digikey: RMCF0402JT10K0TR-ND] 12.1K 1% 1/16W [Digikey: 311-22.0LRTR-ND] 100.0K 5% 1/16W 0603 - 0603 Surface Mount Package 0 Ohm 1/10 Watt 1% Resistor 15 Ohm 1/10 Watt 1% Resistor 33 Ohm 1/10 Watt 1% Resistor 49.9 Ohm 1/10 Watt 1% Resistor 100 Ohm 1/10 Watt 1% Resistor 150 Ohm 1/10 Watt 1% Resistor 240 Ohm 1/10 Watt 1% Resistor 390 Ohm 1/10 Watt 1% Resistor 560 Ohm 1/10 Watt 1% Resistor 680 Ohm 1/10 Watt 1% Resistor 750 Ohm 1/10 Watt 1% Resistor 1.0K Ohm 1/10 Watt 1% Resistor 1.5K Ohm 1/10 Watt 1% Resistor 2.0K Ohm 1/10 Watt 1% Resistor 2.2K Ohm 1/10 Watt 1% Resistor 3.3K Ohm 1/10 Watt 1% Resistor 4.7K Ohm 1/10 Watt 1% Resistor 10.0K Ohm 1/10 Watt 1% Resistor 12.0K Ohm 1/10 Watt 1% Resistor 12.1K Ohm 1/10 Watt 1% Resistor 20.0K Ohm 1/10 Watt 1% Resistor 33.0K Ohm 1/10 Watt 1% Resistor 100.0K Ohm 1/10 Watt 1% Resistor 0805 - 0805 Surface Mount Package 0 Ohm 1/8 Watt 1% Resistor 33 Ohm 1/8 Watt 1% Resistor 100 Ohm 1/8 Watt 1% Resistor 150 Ohm 1/8 Watt 1% Resistor 200 Ohm 1/8 Watt 1% Resistor 240 Ohm 1/8 Watt 1% Resistor 330 Ohm 1/8 Watt 1% Resistor 390 Ohm 1/8 Watt 1% Resistor 470 Ohm 1/8 Watt 1% Resistor 1.0K Ohm 1/8 Watt 1% Resistor 1.5K Ohm 1/8 Watt 1% Resistor 2.0K Ohm 1/8 Watt 1% Resistor 4.7K Ohm 1/8 Watt 1% Resistor 5.1K Ohm 1/8 Watt 1% Resistor 5.6K Ohm 1/8 Watt 1% Resistor 10.0K Ohm 1/8 Watt 1% Resistor 22.0K Ohm 1/8 Watt 1% Resistor 33.0K Ohm 1/8 Watt 1% Resistor 100K Ohm 1/8 Watt 1% Resistor 1206 - 1206 Surface Mount Package 2012 - 2010 Surface Mount Package 0.11 Ohm 1/2 Watt 1% Resistor - Digikey: RHM.11UCT-ND
R12 = 3386P-1-104LF:3386P-1-104LF; COPYRIGHT: Copyright (C) 2024 Ultra Librarian. All rights reserved.; MANUFACTURER_PART_NUMBER: 3386P-1-104LF; MFR_NAME: Bourns Electronics
S1 = SamacSys_Parts:GPTS203211B: Pushbutton Switches SPST ON-OFF Source: Datasheet <http://switches-connectors-custom.cwind.com/Asset/GPTS203211BR2.pdf>; DESCRIPTION: Pushbutton Switches SPST ON-OFF; HEIGHT: mm; MANUFACTURER_NAME: CW Industries; MANUFACTURER_PART_NUMBER: GPTS203211B; MOUSER_PART_NUMBER: 629-GPTS203211B; MOUSER_PRICE-STOCK: https://www.mouser.co.uk/ProductDetail/CW-Industries/GPTS203211B?qs=sajaCoHCXPR%252BmLwibobs6Q%3D%3D
U1 = microbuilder:MAX4466: MAX4466 - Microphone Pre-Amp
U8 = BNO055:BNO055: BNO055 9-axis Absolute Orientation Sensor ( SiP ) w/Sensors and Sensor Fusion Buy Part <https://snapeda.com/parts/BNO055/Bosch/view-part/?ref=eda>; AVAILABILITY: Warning; DESCRIPTION: Accelerometer, Gyroscope, Magnetometer, 9 Axis Sensor I²C, UART Output; DIGIKEY-PURCHASE-URL: https://snapeda.com/shop?store=DigiKey&id=51961; MF: Bosch; MOUSER-PURCHASE-URL: https://snapeda.com/shop?store=Mouser&id=51961; MP: BNO055; PACKAGE: LGA-28 Bosch; PRICE: None
U$1 = Teensy_Audioshield:AUDIOSHIELD: Teensy 3 Audioshield by PJRC.COM
U$7 = pinhead:PINHD-1X10: PIN HEADER
U$11 U$14-U$19 = microbuilder:MOUNTINGHOLE: Mounting Hole For #2 screws (0.086"/2.18mm width, 0.094"/2.4mm hole) use 2.5mm; BOM: EXCLUDE
VR2 = SamacSys_Parts:PT01-D115D-B103: 10k Ohm 1 Gang Linear Through Hole Potentiometer 1.0 Turns Carbon 0.05W, 1/20W PC Pins Source: Datasheet <https://www.cuidevices.com/product/product-resources/pt01.pdf>; DESCRIPTION: 10k Ohm 1 Gang Linear Through Hole Potentiometer 1.0 Turns Carbon 0.05W, 1/20W PC Pins; HEIGHT: 15.5mm; MANUFACTURER_NAME: Same Sky; MANUFACTURER_PART_NUMBER: PT01-D115D-B103; MOUSER_PART_NUMBER: 179-PT01-D115D-B103; MOUSER_PRICE-STOCK: https://www.mouser.co.uk/ProductDetail/Same-Sky/PT01-D115D-B103?qs=Rp5uXu7WBW%252Bmp1sh9GThaA%3D%3D
Y1 = NDK - NX3215SA-32.768K-STD-MUA-8:NDK_NX3215SA-32.768K-STD-MUA-8: Crystal Unit; CENTROID_NOT_SPECIFIED: No; DATASHEET: http://www.ndk.com/images/products/catalog/c_NX3215SA-STD-MUA-14_e.pdf; DIGIKEY_DESCRIPTION: CRYSTAL 32.7680KHZ 12.5PF SMD; DIGIKEY_PART_NUMBER: 644-1156-1-ND; FREQUENCY: 32.768kHz; LEAD_FREE: yes; MF: NDK; MPN: NX3215SA-32.768K-STD-MUA-8; PACKAGE: XTAL_3MM2_1MM5; PREFIX: Y; ROHS: yes; TEMPERATURE_RANGE_HIGH: +85°C; TEMPERATURE_RANGE_LOW: -40°C

## Board
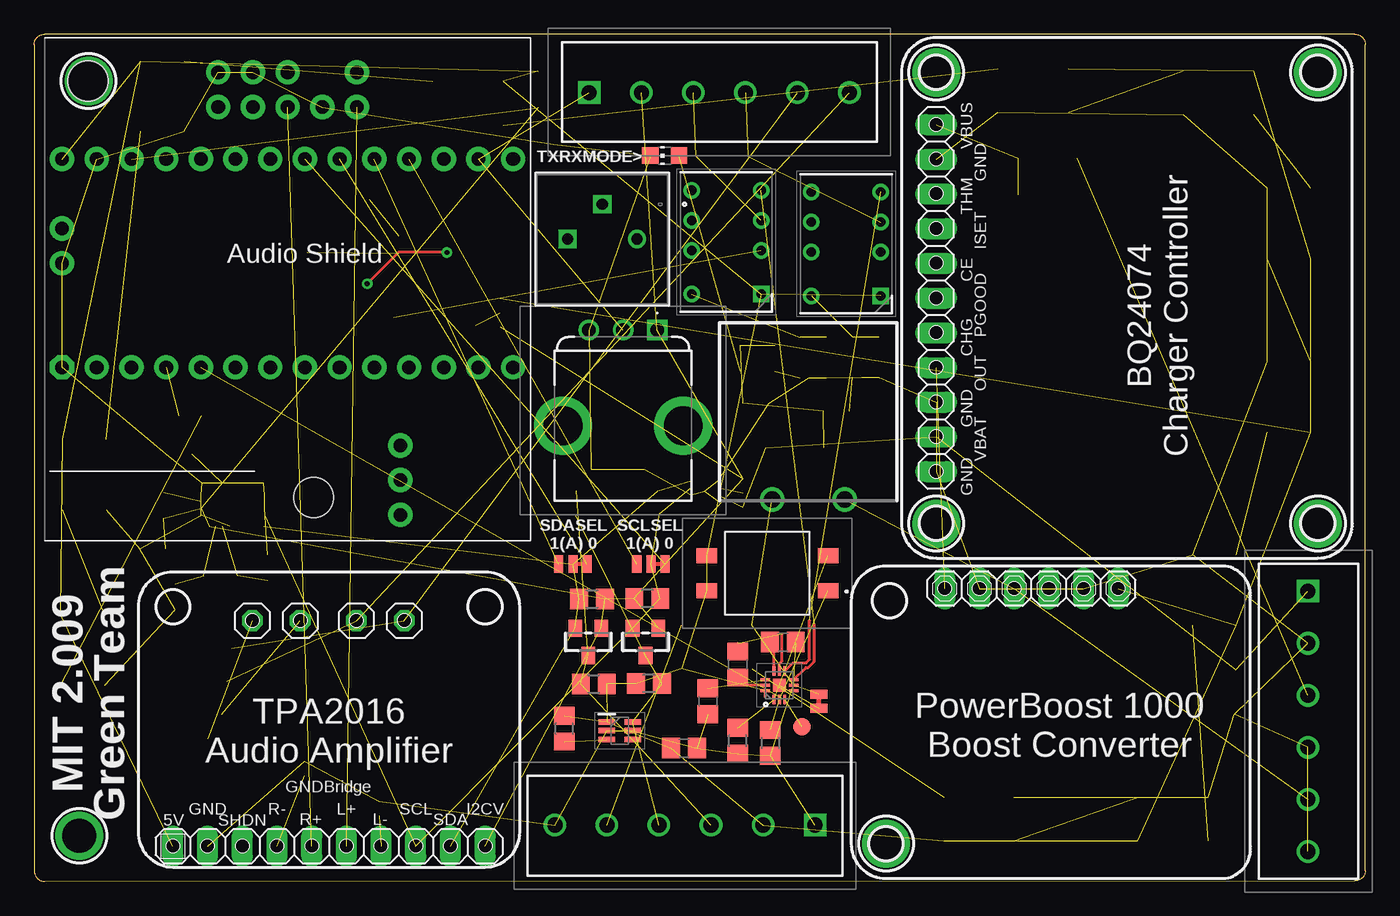
[diagram p5: board, top side]
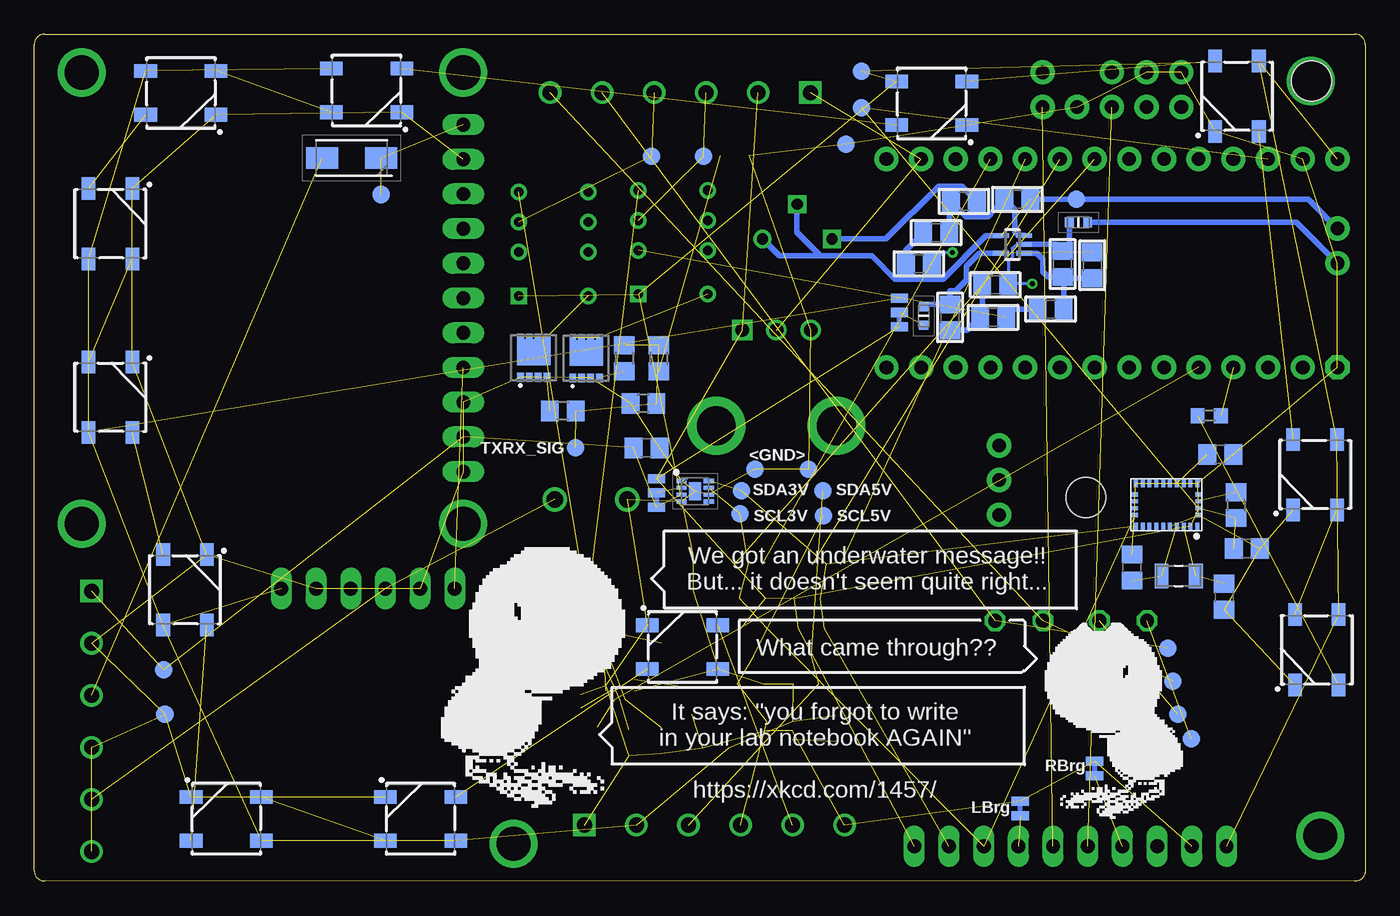
[diagram p6: board, bottom side, seen from below]

Size 97.46 x 62 mm. Coordinates in mm from the lower left corner, seen from the top.
Outline: 0.76,0 96.7,0.03 arc90 97.46,0.79 97.46,61.24 arc90 96.7,62 0.76,62 arc90 0,61.24 0,0.79 arc90 0.76,0
Copper layers (1*16): Top 0.035mm / dielectric 1.5mm / Bottom 0.035mm
Design rules "default": minimum track width 6mil, minimum drill 0.35mm, track to track 6mil, track to pad 6mil, pad to pad 6mil, via to via 6mil, smd to smd 6mil, copper to edge 40mil, drill to drill 6mil, minimum pad ring 10mil, minimum via ring 8mil, stop-mask expansion 4mil, vias tented up to drill 0mil, thermal gap 10mil

### Footprints (pad centres in the part's own frame; a part is rotated, then mirrored left to right if it is on the bottom)
B1,27 = smd 1.27 x 1.27: TP 0,0
C0805 = smd 1.3 x 1.5: 1 -0.95,0; 2 0.95,0
0805 = smd 1.3 x 1.5: 1 -0.95,0; 2 0.95,0
WS2812-5X5-4PIN = smd 1.651 x 1: DI 2.577,1.6; DO -2.577,-1.6; GND 2.577,-1.6; VCC -2.577,1.6
DIOM5226X244N = smd 2.35 x 1.55: 1 -2.15,0; 2 2.15,0
BLM18SP221SN1B = smd 0.65 x 0.7: 1 -0.675,0; 2 0.675,0
SOT65P210X100-6N = smd 1.2 x 0.4: 1 -0.95,0.65; 2 -0.95,0; 3 -0.95,-0.65; 4 0.95,-0.65; 5 0.95,0; 6 0.95,0.65
SON50P200X200X80-9N = smd 0.75 x 0.3: 1 -1,0.75; 2 -1,0.25; 3 -1,-0.25; 4 -1,-0.75; 5 1,-0.75; 6 1,-0.25; 7 1,0.25; 8 1,0.75 | smd 0.9 x 1.3: 9 0,0
QFN40P200X200X80-13N = smd 0.7 x 0.2: 1 -1.05,0.4; 2 -1.05,0; 3 -1.05,-0.4; 7 1.05,-0.4; 8 1.05,0; 9 1.05,0.4 | smd 0.2 x 0.7: 4 -0.4,-1.05; 5 0,-1.05; 6 0.4,-1.05; 10 0.4,1.05; 11 0,1.05; 12 -0.4,1.05 | smd 0.95 x 0.95: 13 0,0
DS04254202BKSMT = smd 1.1 x 1.5: 1 -1.27,-4.45; 2 1.27,-4.45; 3 1.27,4.45; 4 -1.27,4.45
1727052 = drill 1.1 pad 1.65 square: 1 0,0 | drill 1.1 pad 1.65: 2 3.81,0; 3 7.62,0; 4 11.43,0; 5 15.24,0; 6 19.05,0
1X11 = drill 1.016 long: 1 -12.7,0; 2 -10.16,0; 3 -7.62,0; 4 -5.08,0; 5 -2.54,0; 6 0,0; 7 2.54,0; 8 5.08,0; 9 7.62,0; 10 10.16,0; 11 12.7,0
SMT-JUMPER_3_1-NC_TRACE_NO-SILK = smd 0.66 x 1.27: 1 -1.041,0; 2 0,0; 3 1.041,0
1X06 = drill 1.016 long: 1 -6.35,0; 2 -3.81,0; 3 -1.27,0; 4 1.27,0; 5 3.81,0; 6 6.35,0
SMT-JUMPER_2_NC_TRACE_NO-SILK = smd 0.66 x 1.27: 1 -0.521,0; 2 0.521,0
1X01 = drill 1.016 octagon: 1 0,0
G6K2PYDC12 = drill 0.7 pad 1.1 square: 1 0,0 | drill 0.7 pad 1.1: 2 0,-3.2; 3 0,-5.4; 4 0,-7.6; 5 5.08,-7.6; 6 5.08,-5.4; 7 5.08,-3.2; 8 5.08,0
CHIP-LED0805 = smd 1.2 x 1.2: A 0,-1.05; C 0,1.05
CSD16327 = smd 0.5 x 0.63: 1 -0.975,-1.435; 2 -0.325,-1.435; 3 0.325,-1.435; 4 0.975,-1.435 | smd 0.5 x 0.41: 5 0.975,1.545; 6 0.325,1.545; 7 -0.325,1.545; 8 -0.975,1.545 | smd 2.45 x 1.9: 9 0,0.39
SOT23-WIDE = smd 1 x 1.27: 1 -0.95,-1; 2 0.95,-1; 3 0,1
R0805 = smd 1.3 x 1.5: 1 -0.95,0; 2 0.95,0
POT_3386P = drill 0.813 pad 1.321: 1 0,0 | drill 0.813 pad 1.321 square: 2 2.54,-2.54; 3 5.08,0
R0603 = smd 1 x 1.1: 1 -0.85,0; 2 0.85,0
GPTS203211B = drill 1.2 pad 1.8: 1 -0.081,-2.65; 2 -0.081,2.65
SC70-5 = smd 0.35 x 1.15: 1 -0.65,-0.85; 2 0,-0.85; 3 0.65,-0.85; 4 0.65,0.85; 5 -0.65,0.85
LGA28R50P4X10_380X520X100 = smd 0.3 x 0.525: 1 -2.25,1.562; 6 -2.25,-1.562; 7 -1.75,-1.562; 8 -1.25,-1.562; 9 -0.75,-1.562; 10 -0.25,-1.562; 11 0.25,-1.562; 12 0.75,-1.562; 13 1.25,-1.562; 14 1.75,-1.562; 15 2.25,-1.562; 20 2.25,1.562; 21 1.75,1.562; 22 1.25,1.562; 23 0.75,1.562; 24 0.25,1.562; 25 -0.25,1.562; 26 -0.75,1.562; 27 -1.25,1.562; 28 -1.75,1.562 | smd 0.425 x 0.3: 2 -2.312,0.75; 3 -2.312,0.25; 4 -2.312,-0.25; 5 -2.312,-0.75; 16 2.312,-0.75; 17 2.312,-0.25; 18 2.312,0.25; 19 2.312,0.75
AUDIOSHIELD = drill 1 pad 1.778: 0 -13.97,-5.08; 1 -11.43,-5.08; 2 -8.89,-5.08; 3 -6.35,-5.08; 3V -11.43,10.16; 4 -3.81,-5.08; 5 -1.27,-5.08; 5V -16.51,10.16; 6 1.27,-5.08; 7 3.81,-5.08; 8 6.35,-5.08; 9 8.89,-5.08; 10 11.43,-5.08; 11 13.97,-5.08; 12 16.51,-5.08; 13 16.51,10.16; 14 13.97,10.16; 15 11.43,10.16; 16 8.89,10.16; 17 6.35,10.16; 18 3.81,10.16; 19 1.27,10.16; 20 -1.27,10.16; 21 -3.81,10.16; 22 -6.35,10.16; 23 -8.89,10.16; G -13.97,10.16; GND_MIC -16.51,2.54; INGND1 -5.08,16.51; INGND2 -2.54,16.51; INL -5.08,13.97; INR -2.54,13.97; MIC -16.51,5.08; OUTGND 2.54,13.97; OUTL 5.08,13.97; OUTR 0,13.97; UNUSED1 0,16.51; UNUSED2 5.08,16.51; VOL 8.255,-13.335; VOL_3.3V 8.255,-15.875; VOL_GND 8.255,-10.795 | drill 1 pad 1.778 octagon: GND -16.51,-5.08 | hole 2.921: 1.905,-14.605; -14.605,15.875
1X10 = drill 1.016 long: 1 -11.43,0; 2 -8.89,0; 3 -6.35,0; 4 -3.81,0; 5 -1.27,0; 6 1.27,0; 7 3.81,0; 8 6.35,0; 9 8.89,0; 10 11.43,0
MOUNTINGHOLE_2.5_PLATED = drill 2.5 pad 3.2: P$1 0,0
PT01D115DB103 = drill 1 pad 1.5 square: 1 0,0 | drill 1 pad 1.5: 2 2.5,0; 3 5,0 | drill 2.84 pad 4.26: 4 6.9,7; 5 -1.9,7
NDK_NX3215SA-32.768K-STD-MUA-8_0 = smd 1 x 1.8: 1 -1.25,0; 2 1.25,0

### Placement (x,y rotation side)
3V  36.88,56.62 0 bottom
5V  36.88,59.28 0 bottom
5VG  38.02,53.95 0 bottom
BQ_USB_VBUS  72.06,50.27 0 bottom
C1  52.63,31.72 0 bottom
C2  49.33,13.18 270 top
C3  47.57,9.75 0 top
C4  54.81,17.5 0 top
C5  8.69,24.36 0 bottom
C6  51.51,15.87 90 top
C7  27.1,43.66 0 bottom
C8  23.04,41.88 0 bottom
C9  25.48,49.91 180 bottom
C10  32.69,45.19 0 bottom
C16  10.34,20.83 90 bottom
C17  17.09,22.96 270 bottom
C21  10.62,31.24 180 bottom
D1  3.68,29.77 270 bottom
D2  9.4,57.45 270 bottom
D3  31.75,56.95 0 bottom
D4  73.13,57.89 0 bottom
D5  86.72,57.71 0 bottom
D6  91.87,35.43 90 bottom
D7  86.41,21.34 90 bottom
D8  91.87,48.13 90 bottom
D9  83.39,4.57 180 bottom
D10  69.16,4.57 180 bottom
D11  49.99,17.14 180 bottom
D12  74.22,52.93 180 bottom
D13  3.56,16.94 270 bottom
FB2  21.01,48.23 0 bottom
FB3  32.33,41.38 270 bottom
HYD_COM1  48.44,53.06 0 bottom
HYD_COM2  52.25,53.06 0 bottom
HYD_RX_AMP  21.16,49.91 180 bottom
HYD_TX_SIG  56.21,11.3 90 top
IC1  42.88,11.02 0 top
IC2  49.07,28.55 0 bottom
IC3  54.56,14.35 90 top
IC4  53.68,22.55 90 top
J2  40.64,57.72 0 top
J3  57.17,4.12 180 top
J4  93.25,21.23 270 top
JP1  66.04,42.68 270 top
JP2  39.45,23.22 0 top
JP3  45.16,23.22 0 top
JP4  73.02,21.42 180 top
JP5  19.81,8.25 270 bottom
JP6  25.27,5.33 270 bottom
JP7  27.1,19.08 90 top
JP8  51.89,28.42 270 bottom
JP9  57.45,13.18 270 top
JP11  23.6,19.08 90 top
JP12  15.98,19.08 90 top
JP13  19.48,19.08 90 top
JP14  34.11,41.63 270 bottom
K1  53.22,42.98 180 top
K2  61.98,42.85 180 top
LED2  46.16,53.11 90 top
Q1  57.05,38.28 0 bottom
Q2  60.88,38.33 0 bottom
Q3  40.56,17.53 180 top
Q4  44.75,17.53 180 top
R1  38.81,11.18 90 top
R2  40.84,20.68 0 top
R3  44.88,20.7 180 top
R4  51.51,10.29 90 top
R5  53.9,10.13 270 top
R6  27.25,41.28 180 bottom
R7  30.4,41.28 90 bottom
R8  31.42,47.47 0 bottom
R9  22.17,45.19 270 bottom
R10  19.99,45.08 90 bottom
R11  29.39,49.76 0 bottom
R12  44.14,47.01 180 top
R13  11.43,34.09 180 bottom
R14  58.75,34.42 180 bottom
R17  40.97,14.45 0 top
R18  45.01,14.48 180 top
R23  54.25,38.28 270 bottom
R27  52.86,34.98 180 bottom
R29  51.71,38.28 90 bottom
R32  9.47,27.53 270 bottom
S1  56.68,27.87 270 top
SCL_3V  45.77,26.9 0 bottom
SCL_5V  39.67,26.77 0 bottom
SCLG  44.7,30.15 180 bottom
SDA_3V  45.67,28.57 180 bottom
SDA_5V  39.7,28.57 180 bottom
SDAG  40.77,30.15 0 bottom
TP_TXRX  57.84,31.72 0 bottom
TPA_L+  14.48,17.07 270 bottom
TPA_L-  14.1,14.66 270 bottom
TPA_R+  12.75,10.44 270 bottom
TPA_R-  13.72,12.24 270 bottom
U1  25.83,46.61 90 bottom
U8  14.55,27.56 180 bottom
U$1  18.55,42.7 0 top
U$7  21.59,2.57 0 top
U$11  93.98,59.19 270 top
U$14  66.04,59.19 270 top
U$15  62.37,2.76 0 top
U$16  66.04,26.17 270 top
U$17  93.98,26.17 270 top
U$18  3.99,58.57 0 top
U$19  3.31,3.34 0 top
VBAT  87.96,15.47 0 bottom
VBAT1  87.88,12.24 0 bottom
VR2  45.62,40.34 180 top
Y1  13.67,22.35 180 bottom

### Tracks (layer width: path | path; a pad name or v marks a point on that pad's centre or on a via)
3.3V  (14 unrouted)
3.3VI2C_SCL0  (1 unrouted)
3.3VI2C_SCL1  (1 unrouted)
3.3VI2C_SDA0  (1 unrouted)
3.3VI2C_SDA1  (1 unrouted)
5V  (27 unrouted)
  Top 0.203: IC3.12 53.51,13.47
AGND  (via drill 0.35)
  Top 0.203: v30.23,46.02 26.67,46.02 v24.38,43.74
  Bottom 0.203: U1.2 25.06,46.53 25.65,46.53 25.85,46.33 25.85,45.68 26.15,45.38 C7.2 26.08,43.74 v24.38,43.74 | C10.2 30.9,46.02 v30.23,46.02
  Bottom 0.406: FB2.1 21.68,46.63 R9.1 22.65,46.61 U1.2
AVCC  (1 unrouted)
  Bottom 0.406: U1.5 28.26,45.96 29.21,45.01 29.21,43.99 29.99,43.21 30.4,43.21 R7.2 32.16,42.22 FB3.1
BONECOND_+  (2 unrouted)
BONECOND_-  (2 unrouted)
BQ_LOAD_OUT  (1 unrouted)
BQ_USB_VBUS  (2 unrouted)
GND  (70 unrouted)
  Bottom 0.406: U$1.GND_MIC 5.04,48.23 FB2.2
HYD_COM1  (2 unrouted)
HYD_COM2  (2 unrouted)
HYD_RX_IN1  (1 unrouted)
  Bottom 0.406: C8.1 25.7,41.88 R6.1
HYD_RX_INPUT  (1 unrouted)
  Bottom 0.406: C9.1 HYD_RX_AMP.TP 4.18,49.91 U$1.MIC | U1.4 27.77,47.26 30.94,44.08 34.44,44.08 36.13,45.77 39.37,45.77 39.88,45.77 | 39.88,45.77 41.6,47.49 R12.2 | R12.1 42.9,45.77 39.88,45.77
HYD_TX_OUT1  (1 unrouted)
  Top 0.203: IC3.6 56.49,15.63 56.67,15.63 57.12,16.09 57.12,18.85
HYD_TX_OUT2  (1 unrouted)
  Top 0.203: IC3.7 55.55,15.99 56.52,15.99 56.77,16.24 56.77,19.1
HYD_TX_SIG  (2 unrouted)
IMU_CLK1  (2 unrouted)
IMU_CLK2  (2 unrouted)
LED_BRIDGE  (1 unrouted)
LED_DIN  (1 unrouted)
LED_DOUT  (1 unrouted)
N$1  (1 unrouted)
N$2  (1 unrouted)
N$3  (1 unrouted)
N$4  (1 unrouted)
N$5  (1 unrouted)
N$6  (1 unrouted)
N$7  (1 unrouted)
N$8  (1 unrouted)
N$9  (1 unrouted)
N$10  (1 unrouted)
N$11  (1 unrouted)
N$12  (2 unrouted)
N$13  (2 unrouted)
N$15  (1 unrouted)
N$16
  Bottom 0.406: C7.1 28.05,41.43 R6.2 29.15,40.32 R7.1
N$17
  Bottom 0.406: R9.2 23.26,44.24 23.62,44.6 23.62,45.52 24.06,45.96 U1.1 | R9.2 22.07,44.13 R10.1 | R9.2 22.09,44.15 C8.2
N$18  (1 unrouted)
N$19
  Bottom 0.406: R8.2 30.47,49.63 | 30.47,49.63 R11.1 | U1.3 25.02,47.29 25.4,47.29 25.65,47.55 25.65,49.14 C9.2 27.43,48.9 27.43,48.86 27.64,48.65 29.23,48.65 30.21,49.63 30.47,49.63
N$20
  Bottom 0.406: R8.1 33.64,46.2 C10.1
N$21
  Bottom 0.406: R11.2 29.33,50.65 29.33,50.66 29.54,50.86 31.23,50.86 35.08,47.01 R12.3
N$24  (1 unrouted)
N$25  (1 unrouted)
N$26  (1 unrouted)
N$27  (1 unrouted)
N$28  (1 unrouted)
N$29  (1 unrouted)
N$30  (1 unrouted)
N$31  (1 unrouted)
N$32  (1 unrouted)
N$37  (1 unrouted)
N$40  (1 unrouted)
N$81  (1 unrouted)
N$82  (1 unrouted)
PAM_CN1  (1 unrouted)
PAM_CN2  (1 unrouted)
  Top 0.203: 54.77,18.1 54.77,16.14 54.56,15.93 IC3.8 | C6.2 51.51,17.42
PAM_CP1
  Top 0.203: IC3.9 54.16,17.2 C4.1
PAM_CP2
  Top 0.203: IC3.11 52.09,14.35 C6.1
PB1K_EN  (2 unrouted)
SCL_3V  (6 unrouted)
SCL_5V  (4 unrouted)
SDA_3V  (6 unrouted)
SDA_5V  (4 unrouted)
TPA_L+  (1 unrouted)
TPA_R+  (1 unrouted)
TXRX_OUT1  (4 unrouted)
TXRX_OUT2  (4 unrouted)
TXRX_RELAY  (4 unrouted)
VBAT  (5 unrouted)
VOL_POT_SIG  (2 unrouted)

### Text on the board
tPlace: VBUS | GND | TXRXMODE> | THM | ISET | CE | PGOOD | CHG | BQ24074 / Charger Controller | OUT | GND | VBAT | GND | SDASEL / 1(A) 0 | SCLSEL / 1(A) 0 | MIT 2.009 | Green Team | TPA2016 / Audio Amplifier | PowerBoost 1000 / Boost Converter | GNDBridge | GND | R- | L+ | SCL | I2CV | 5V | SHDN | R+ | L- | SDA
bPlace: <GND> | TXRX_SIG | SDA5V | SDA3V | SCL5V | SCL3V | We got an underwater message!! / But... it doesn't seem quite right... | What came through?? | It says: "you forgot to write / in your lab notebook AGAIN" / / https://xkcd.com/1457/ | RBrg | LBrg